# Altium schematic sheet main.SchDoc: GMAO IoT
size A3; Author: Alejandro Lemos; Organization: Protipark; Address1: Somewhere; Address2: Colombia; Address4: Open Hardware; DocumentNumber: 1; Revision: A; SheetNumber: 1; SheetTotal: 1
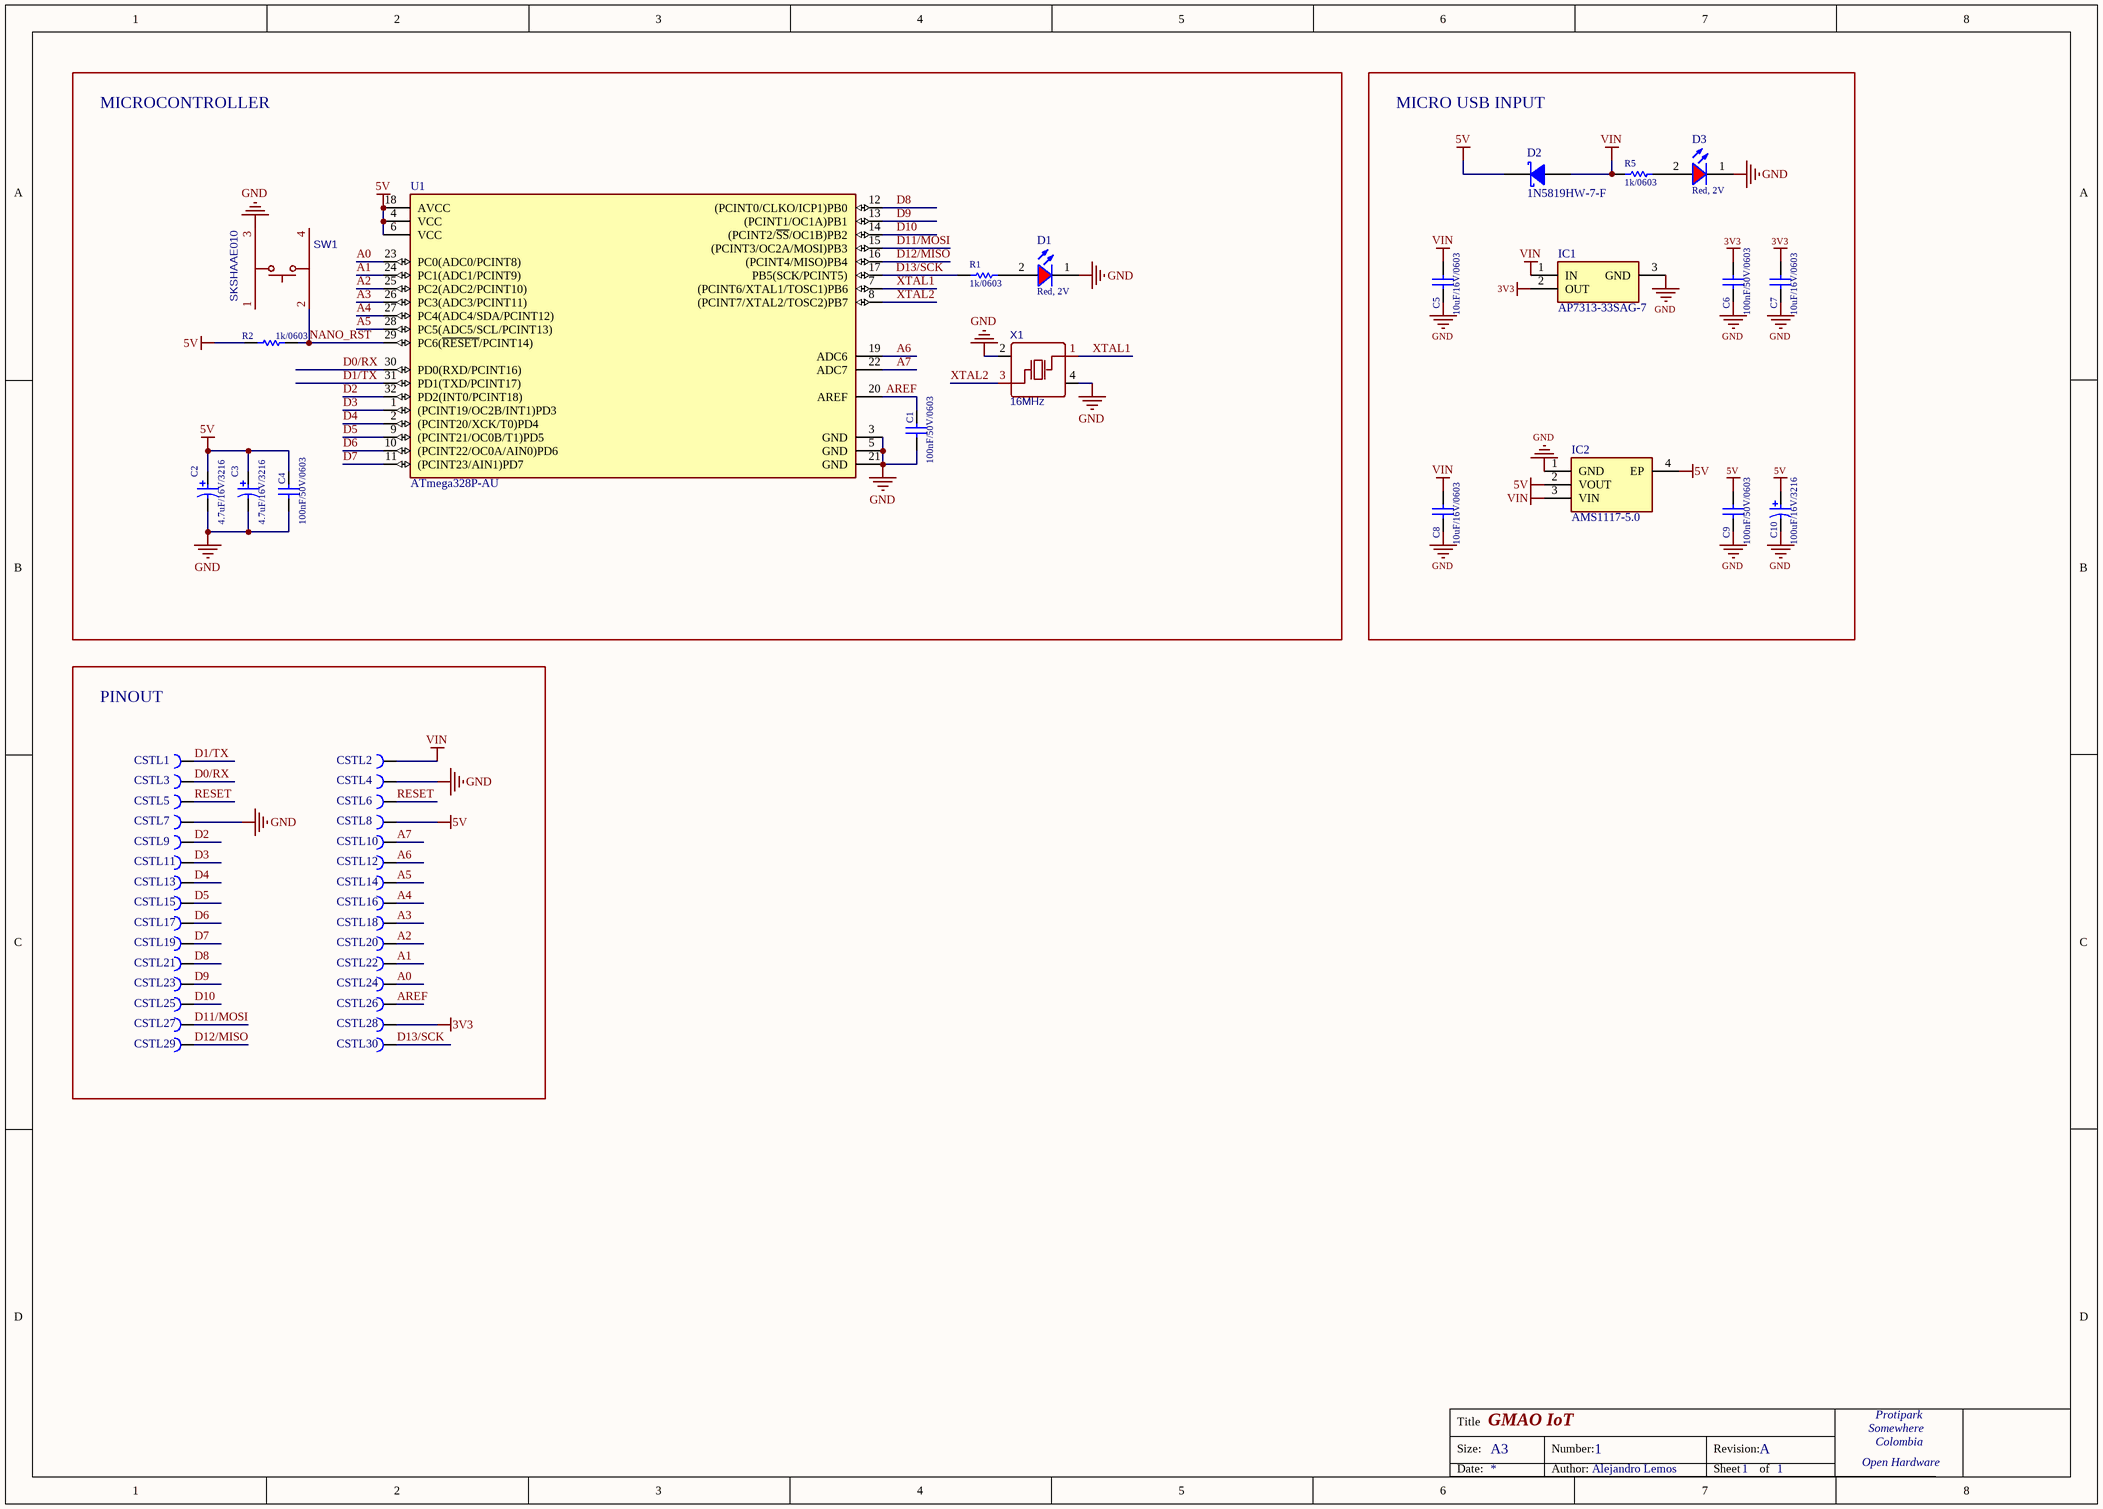
[diagram p0: main.SchDoc]

## Parts
C1  100nF/50V/0603  [C0603_L]
C2  4.7uF/16V/3216  [KEMT-T491-A_L]
C3  4.7uF/16V/3216  [KEMT-T491-A_L]
C4  100nF/50V/0603  [C0603_L]
C5  10uF/16V/0603  [C0603_L]
C6  100nF/50V/0603  [C0603_L]
C7  10uF/16V/0603  [C0603_L]
C8  10uF/16V/0603  [C0603_L]
C9  100nF/50V/0603  [C0603_L]
C10  100uF/16V/3216  [KEMT-T491-A_L]
CSTL1  CASTELLATED  [CASTELLATED]  (value not drawn)
CSTL2  CASTELLATED  [CASTELLATED]  (value not drawn)
CSTL3  CASTELLATED  [CASTELLATED]  (value not drawn)
CSTL4  CASTELLATED  [CASTELLATED]  (value not drawn)
CSTL5  CASTELLATED  [CASTELLATED]  (value not drawn)
CSTL6  CASTELLATED  [CASTELLATED]  (value not drawn)
CSTL7  CASTELLATED  [CASTELLATED]  (value not drawn)
CSTL8  CASTELLATED  [CASTELLATED]  (value not drawn)
CSTL9  CASTELLATED  [CASTELLATED]  (value not drawn)
CSTL10  CASTELLATED  [CASTELLATED]  (value not drawn)
CSTL11  CASTELLATED  [CASTELLATED]  (value not drawn)
CSTL12  CASTELLATED  [CASTELLATED]  (value not drawn)
CSTL13  CASTELLATED  [CASTELLATED]  (value not drawn)
CSTL14  CASTELLATED  [CASTELLATED]  (value not drawn)
CSTL15  CASTELLATED  [CASTELLATED]  (value not drawn)
CSTL16  CASTELLATED  [CASTELLATED]  (value not drawn)
CSTL17  CASTELLATED  [CASTELLATED]  (value not drawn)
CSTL18  CASTELLATED  [CASTELLATED]  (value not drawn)
CSTL19  CASTELLATED  [CASTELLATED]  (value not drawn)
CSTL20  CASTELLATED  [CASTELLATED]  (value not drawn)
CSTL21  CASTELLATED  [CASTELLATED]  (value not drawn)
CSTL22  CASTELLATED  [CASTELLATED]  (value not drawn)
CSTL23  CASTELLATED  [CASTELLATED]  (value not drawn)
CSTL24  CASTELLATED  [CASTELLATED]  (value not drawn)
CSTL25  CASTELLATED  [CASTELLATED]  (value not drawn)
CSTL26  CASTELLATED  [CASTELLATED]  (value not drawn)
CSTL27  CASTELLATED  [CASTELLATED]  (value not drawn)
CSTL28  CASTELLATED  [CASTELLATED]  (value not drawn)
CSTL29  CASTELLATED  [CASTELLATED]  (value not drawn)
CSTL30  CASTELLATED  [CASTELLATED]  (value not drawn)
D1  Red, 2V  [WL-SMCW_0603_H=0.7mm]
D2  1N5819HW-7-F  [SOD-123]
D3  Red, 2V  [WL-SMCW_0603_H=0.7mm]
IC1  AP7313-33SAG-7  [SOT96P240X110-3N]
IC2  AMS1117-5.0  [SOT290P700X180-4N]
R1  1k/0603  [R0603_N]
R2  1k/0603  [R0603_N]
R5  1k/0603  [R0603_N]
SW1  SKSHAAE010  [SW-SMD_4P-L3.2-W2.9-P2.20-LS3.4]
U1  ATmega328P-AU  [FP-32A-MFG]
X1  16MHz  [CRYSTAL-SMD_4P-L3.2-W2.5-BL]

## Blocks framed on the sheet
MICROCONTROLLER: C1-C4 D1 R1 R2 SW1 U1 X1
MICRO USB INPUT: C5-C10 D2 D3 IC1 IC2 R5
PINOUT: CSTL1-CSTL30

## Nets
3V3: C6.2 C7.2 CSTL28.0 IC1.2(OUT)
5V: C2.1 C3.1 C4.2 C9.2 C10.1 CSTL8.0 D2.2(K) IC2.2(VOUT) IC2.4(EP) R2.1 U1.4(VCC) U1.6(VCC) U1.18(AVCC)
GND: C1.2 C2.2 C3.2 C4.1 C5.1 C6.1 C7.1 C8.1 C9.1 C10.2 CSTL4.0 CSTL7.0 D1.1(K) D3.1(K) IC1.3(GND) IC2.1(GND) SW1.3 U1.3(GND) U1.5(GND) U1.21(GND) X1.2(GND) X1.4(GND)
VIN: C5.2 C8.2 CSTL2.0 D2.1(A) IC1.1(IN) IC2.3(VIN) R5.2
A0: CSTL24.0 U1.23(PC0(ADC0/PCINT8))
A1: CSTL22.0 U1.24(PC1(ADC1/PCINT9))
A2: CSTL20.0 U1.25(PC2(ADC2/PCINT10))
A3: CSTL18.0 U1.26(PC3(ADC3/PCINT11))
A4: CSTL16.0 U1.27(PC4(ADC4/SDA/PCINT12))
A5: CSTL14.0 U1.28(PC5(ADC5/SCL/PCINT13))
A6: CSTL12.0 U1.19(ADC6)
A7: CSTL10.0 U1.22(ADC7)
AREF: C1.1 CSTL26.0 U1.20(AREF)
D0/RX: CSTL3.0 U1.30(PD0(RXD/PCINT16))
D1/TX: CSTL1.0 U1.31(PD1(TXD/PCINT17))
D2: CSTL9.0 U1.32(PD2(INT0/PCINT18))
D3: CSTL11.0 U1.1((PCINT19/OC2B/INT1)PD3)
D4: CSTL13.0 U1.2((PCINT20/XCK/T0)PD4)
D5: CSTL15.0 U1.9((PCINT21/OC0B/T1)PD5)
D6: CSTL17.0 U1.10((PCINT22/OC0A/AIN0)PD6)
D7: CSTL19.0 U1.11((PCINT23/AIN1)PD7)
D8: CSTL21.0 U1.12((PCINT0/CLKO/ICP1)PB0)
D9: CSTL23.0 U1.13((PCINT1/OC1A)PB1)
D10: CSTL25.0 U1.14((PCINT2/~{SS}/OC1B)PB2)
D11/MOSI: CSTL27.0 U1.15((PCINT3/OC2A/MOSI)PB3)
D12/MISO: CSTL29.0 U1.16((PCINT4/MISO)PB4)
D13/SCK: CSTL30.0 R1.2 U1.17(PB5(SCK/PCINT5))
NANO_RST: R2.2 SW1.2 U1.29(PC6(~{RESET}/PCINT14))
RESET: CSTL5.0 CSTL6.0
XTAL1: U1.7((PCINT6/XTAL1/TOSC1)PB6) X1.1(OSC1)
XTAL2: U1.8((PCINT7/XTAL2/TOSC2)PB7) X1.3(OSC2)
NetD1_2: D1.2(A) R1.1
NetD3_2: D3.2(A) R5.1

Not connected (* = marked no-connect by the designer): SW1 1 4

## Notes on the sheet
- Title
- Size:
- A3
- Number:
- Revision:
- Date:
- Author:
- Sheet
- of

## Library data of the parts
C1 C4-C9 = C_SMD
  C1 C4 C6 C9: Value: 100nF/50V/0603
  C5 C7 C8: Value: 10uF/16V/0603
C2 C3 C10 = CMP-2000-07187-1: Tantalum Capacitor, 2.2 uF, +/- 10%, 16 V, -55 to 125 degC, 2-Pin SMD, RoHS, Tape and Reel; Manufacturer: Kemet; Capacitance: 2200000pF; Product Depth (mm): 1.6mm; DCL: 0.4uA; Wire Form: NotRequired; Case Style: Molded; ESR: 6ohm; Polarity: Polar; Product Length (mm): 3.2mm; Voltage: 16VDC; Lead Spacing (nom): NotRequiredmm; DF: 6%; Rad Hardened: No; Operating Temp Range: -55Cto125C; Datasheet Version: 10/2016; Packaging: TapeandReel; Mounting Style: SurfaceMount; Manufacturer URL: http://www.kemet.com/; Seal: NotRequired; Product Height (mm): 1.6mm; Construction: SMTChip; Length W/Weld: NotRequiredmm; Package Reference: T491-A; Package Description: 2-Pin Surface Mount Device, Body 3.2 x 1.6 mm; Tolerance (+ or -): 10%; Length W/Weld (max): NotRequiredmm; Insulation: NotRequired; Mounting Technology: SurfaceMount; Package / Case: 3216-18; Seated Plane Height: NotRequiredmm; Case Code: A; Datasheet URL: http://capacitoredge.kemet.com/capedge2/DataSheet/Datasheet-T491A225K016AT.pdf?pn=T491A225K016AT; Product Diameter (mm): NotRequiredmm; Failure Rate: NotRequired
D1 D3 = 150060RS75000: WL-SMCW SMT Mono-color Chip LED Waterclear, size 0603, Red, 2V, 140deg; Chip Technology: AlInGaP; Dominant Wavelength typ.: 625nm; Luminous Intensity typ.: 250mcd; Peak Wavelength typ.: 630nm; Viewing Angle: 140deg; ComponentLink1Description: Manufacturer; ComponentLink1URL: http://www.we-online.de; ComponentLink2URL: https://www.we-online.com/catalog/datasheet/150060RS75000.pdf; ComponentLink2Description: Datasheet; Forward Voltage typ.: 2V; Emitting Color: Red; Mounting Technology: SMT; Operating Temperature: -40 to +85degC; Published Date: December 2019; Part Number: 150060RS75000; Packaging: Tape and Reel; Size: 0603; Publisher: Wurth Elektronik
D2 = 1N5819HW-7-F: DIODE SCHOTTKY 40V 1A SOD123; Manufacturer: MCC; Manufacturer Part Number: MMSS8050-H-TP; Max Power Dissipation: 625mW; Collector Emitter Voltage (VCEO): 500mV; Max Collector Current: 1.5A; hFE Min: 120; Polarity: NPN; Emitter Base Voltage (VEBO): 5V; Collector Emitter Breakdown Voltage: 25V; Transition Frequency: 100MHz; Element Configuration: Single; Supplier 1: Digi-Key; Stock 1: 71382; Pricing 1: 1 = 0,20000, 10 = 0,18200, 25 = 0,17280, 100 = 0,09890, 250 = 0,07336, 500 = 0,06090, 1000 = 0,04152 (USD); RoHS: Yes; Mount: Surface Mount; Case/Package: SOT-23; Number of Pins: 3; Min Operating Temperature: -55°C; Max Operating Temperature: 150°C; Collector Base Voltage (VCBO): 40V; Packaging: Tape and Reel; Package Quantity: 3000; Gain Bandwidth Product: 100MHz; Collector Emitter Saturation Voltage: 500mV; Max Breakdown Voltage: 25V; Lead Free: Lead Free; ComponentLink1URL: https://datasheet.ciiva.com/16291/mmss8050-255048-16291447.pdf?src-supplier=Mouser; ComponentLink1Description: https://datasheet.ciiva.com/16291/mmss8050-255048-16291447.pdf?src-supplier=Mouser; ComponentLink2URL: https://datasheet.ciiva.com/972/mmss8050sot-23-972893.pdf?src-supplier=Digi-Key; ComponentLink2Description: https://datasheet.ciiva.com/972/mmss8050sot-23-972893.pdf?src-supplier=Digi-Key; ComponentLink3URL: https://datasheet.ciiva.com/972/mmss8050sot-23-972894.pdf?src-supplier=Digi-Key; ComponentLink3Description: https://datasheet.ciiva.com/972/mmss8050sot-23-972894.pdf?src-supplier=Digi-Key; ComponentLink4URL: https://datasheet.ciiva.com/972/mmss8050sot-23-972895.pdf?src-supplier=Digi-Key; ComponentLink4Description: https://datasheet.ciiva.com/972/mmss8050sot-23-972895.pdf?src-supplier=Digi-Key
IC1 = AP7313-33SAG-7: Integrated Circuit; Manufacturer_Name: Diodes Inc.; Datasheet Link: https://componentsearchengine.com/Datasheets/1/AP7313-33SAG-7.pdf; Height: 1.1mm; Manufacturer_Part_Number: AP7313-33SAG-7; Mouser Part Number: 621-AP7313-33SAG-7; Mouser Price/Stock: https://www.mouser.co.uk/ProductDetail/Diodes-Incorporated/AP7313-33SAG-7?qs=vIZ3oKQCLxqCi%2Fx0D85D2g%3D%3D; Arrow Part Number: AP7313-33SAG-7; Arrow Price/Stock: https://www.arrow.com/en/products/ap7313-33sag-7/diodes-incorporated?region=nac
IC2 = AMS1117-5.0: Integrated Circuit; Manufacturer_Name: Shikues; Datasheet Link: https://datasheet.lcsc.com/szlcsc/SK-AMS1117-5-0_C165483.pdf; Height: 1.8mm; Manufacturer_Part_Number: AMS1117-5.0
R1 R2 R5 = R_SMD: Value: 1k/0603
SW1 = SKSHAAE010: SWITCH; BOM_Manufacturer: ALPS Electric; Contributor: LCSC; BOM_Supplier: LCSC; BOM_Supplier Part: C262415; BOM_Manufacturer Part: SKSHAAE010; spicePre: S; spiceSymbolName: SKSHAAE010
U1 = CMP-06276-000013-1: IC MCU 8BIT 32KB FLASH 32TQFP; Manufacturer: Microchip; Nominal Supply Current: 0.04-5.2mA; Number Of Timers/Counters: 3; Number Of Adc Channels: 8; Number Of I2C Channels: 1; Min Supply Voltage: 1.8V; Standoff Height: 0.05mm; Data Bus Width: 8bits; Ram Size: 2KBytes; Max Supply Voltage: 5.5V; Interface: I2C,SPI,UART,USART,2-Wire; Frequency: 20MHz; Number Of Pwm Channels: 6; Memory Size: 32KBytes; Number Of I/Os: 23; Core Architecture: AVR; Temperature: -40°C to +85°C; Number Of Spi Channels: 1; Digikey Description: IC MCU 8BIT 32KB FLASH 32TQFP; Category: IC; RoHS: TRUE; Memory Type: FLASH; Package: 32A; ComponentLink2Description: Datasheet; Number Of Uart Channels: 1; Temperature Range High: +85°C; Octopart: https://octopart.com/atmega328p-au-microchip-77760215; Footprint Url: http://ww1.microchip.com/downloads/en/appnotes/atmel-8826-seeprom-pcb-mounting-guidelines-surface-mount-packages-applicationnote.pdf; Lead Free: Yes; Device Class L1: Integrated Circuits (ICs); Device Class L2: Embedded Processors and Controllers; Ipc Land Pattern Name: QFP80P900X900X120-32; Number Of A/D Converters: 1; Number Of Cores: 1; Automotive: No; Temperature Range Low: -40°C; Mouser Description: ATmega Series 32 KB Flash 2 KB SRAM 20 MHz 8-Bit Microcontroller - TQFP-32; ComponentLink2URL: http://ww1.microchip.com/downloads/en/DeviceDoc/ATmega48A-PA-88A-PA-168A-PA-328-P-DS-DS40002061A.pdf; Height: 1.2mm; Manufacturer Part Number: ATmega328P-AU; Device Class L3: Microcontrollers
X1 = 16MHz: BOM_Manufacturer: YXC; BOM_Manufacturer Part: X322516MOB4SI; nameAlias: Frequency; BOM_Paste Type: Extended Part; BOM_Supplier: LCSC; BOM_Supplier Part: C12668; BOM_JLCPCB Part Class: Extended Part; spicePre: X; spiceSymbolName: X322516MOB4SI